# Altium schematic sheet SSR_MODULE.SchDoc
size A4
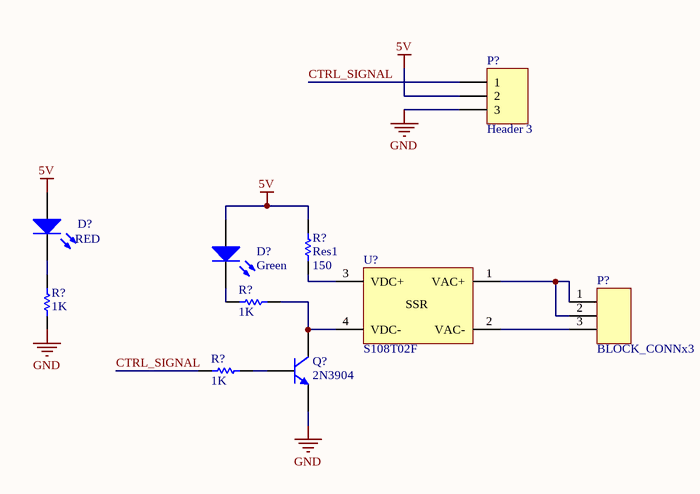
[diagram p0: SSR_MODULE.SchDoc]

## Parts
(Parts that share a designator on the sheet are numbered #1, #2 ... from top to bottom, then left to right.)
D?#1  RED  [R0603_L]
D?#2  Green  [R0603_L]
P?#1  Header 3  [HDR1X3]
P?#2  BLOCK_CONNx3  [BLOCK_CONNx3]
Q?  2N3904  [TO-92A]
R?#1  Res1  value 150  [AXIAL-0.3]
R?#2  value 1K  [R0603_N]  (hidden comment: R_SMD)
R?#3  value 1K  [R0603_N]  (hidden comment: R_SMD)
R?#4  value 1K  [R0603_N]  (hidden comment: R_SMD)
U?  S108T02F  [ZC_4-ZSIP]

## Nets
5V: D?#1.1(A) D?#2.1(A) P?#1.2 R?#1.2
GND: P?#1.3 Q?.1(E) R?#2.2
CTRL_SIGNAL: P?#1.1 R?#4.2
NetD?#1_2: D?#1.2(K) R?#2.1
NetD?#2_2: D?#2.2(K) R?#3.2
NetP?#2_1: P?#2.1 P?#2.2 U?.1(VAC+)
NetP?#2_3: P?#2.3 U?.2(VAC-)
NetQ?_2: Q?.2(B) R?#4.1
NetQ?_3: Q?.3(C) R?#3.1 U?.4(VDC-)
NetR?#1_1: R?#1.1 U?.3(VDC+)

## Notes on the sheet
- (in symbol S108T02F) SSR

## Library data of the parts
D?#1 D?#2 = LED_SMD
  D?#1: Color: RED
  D?#2: Color: Green
P?#1 = Header 3: Header, 3-Pin; LatestRevisionDate: 17-Jul-2002; LatestRevisionNote: Re-released for DXP Platform.; Publisher: Altium Limited
P?#2 = BLOCK_CONNx3: TERM BLOCK 5.08MM VERT 3POS PCB; Manufacturer: On Shore Technology Inc; Manufacturer Part Number: OSTTC032162; Number of Levels: 1; Positions Per Level: 3; Pitch: 0.200" (5.08mm); Mating Orientation: Horizontal with Board; Current: 15A; Voltage: 300V; Wire Gauge: 14-22 AWG; Wire Termination: Screw - Leaf Spring, Wire Guard; Clamp Material - Plating: Steel, Stainless; Screw Material - Plating: Steel - Zinc Plated; Torque - Screw: 0.3 Nm (2.6 Lb-In); Screw Thread: M2.6; Supplier 1: Digi-Key; RoHS: RoHS Compliant; Category: Connectors, Interconnects; Stock 1: 4040; Pricing 1: 1=0.51, 10=0.48, 50=0.384, 100=0.368, 250=0.336, 500=0.32, 1000=0.264, 2500=0.24, 5000=0.232 (USD); Packaging: Bulk; Mounting Type: Through Hole; Features: Interlocking (Side); Color: Blue; Operating Temperature: -30°C ~ 105°C; Housing Material: Thermoplastic; Contact Material - Plating: Tin Plated; ComponentLink1URL: http://www.on-shore.com/sites/default/files/manuals/osttcxx2162.pdf; ComponentLink1Description: http://www.on-shore.com/sites/default/files/manuals/osttcxx2162.pdf; Supplier Part Number 1: ED2610-ND
Q? = 2N3904: NPN General Purpose Amplifier; Published: 8-Jun-2000; LatestRevisionDate: 15-Jan-2003; LatestRevisionNote: PCB Footprint 'BCY-W3/D4.7' replaced; DatasheetVersion: 1997; PackageVersion: Sep-1998; PackageReference: TO-92A; Publisher: Altium Limited; PackageDescription: TO, Flat Index; 3 In-Line, Axial Leads; Body Dia. 4.5mm; Leads 0.51 x 0.48 mm (max); ComponentLink1Description: Manufacturer Link; ComponentLink1URL: http://www.fairchildsemi.com/; ComponentLink2Description: Datasheet; ComponentLink2URL: http://www.fairchildsemi.com/ds/2N%2F2N3904.pdf
R?#1 = Res1: Resistor; Published: 8-Jun-2000; LatestRevisionDate: 17-Jul-2002; LatestRevisionNote: Re-released for DXP Platform.; PackageReference: AXIAL-0.3; Publisher: Altium Limited; PackageDescription: Axial Device, Thru-Hole; 2 Leads; 0.3 in Pin Spacing
U? = S108T02F: RELAY SSR 120VAC 8A ZC 4-SIP; Manufacturer: Sharp Microelectronics; Circuit: SPST-NO (1 Form A); Output Type: AC, Zero Cross; Voltage - Input: 1.2VDC; Voltage - Load: 80 ~ 120 V; Supplier 1: Digi-Key; Manufacturer Part Number: S108T02F; RoHS: RoHS Compliant; Category: Relays; Stock 1: 919; Pricing 1: 1=5.1, 10=4.08, 25=3.876, 100=3.366, 500=2.958, 750=2.7948, 1000=2.652, 2500=2.55, 5000=2.4888 (USD); Packaging: Tube; On-State Resistance: -; Load Current: 8A; Mounting Type: Through Hole; Termination Style: PC Pin; Package / Case: 4-SIP; Supplier Device Package: 4-SIP; Relay Type: Relay; ComponentLink1URL: http://www.sharpsma.com/webfm_send/315; ComponentLink1Description: http://www.sharpsma.com/webfm_send/315; Supplier Part Number 1: 425-2396-5-ND